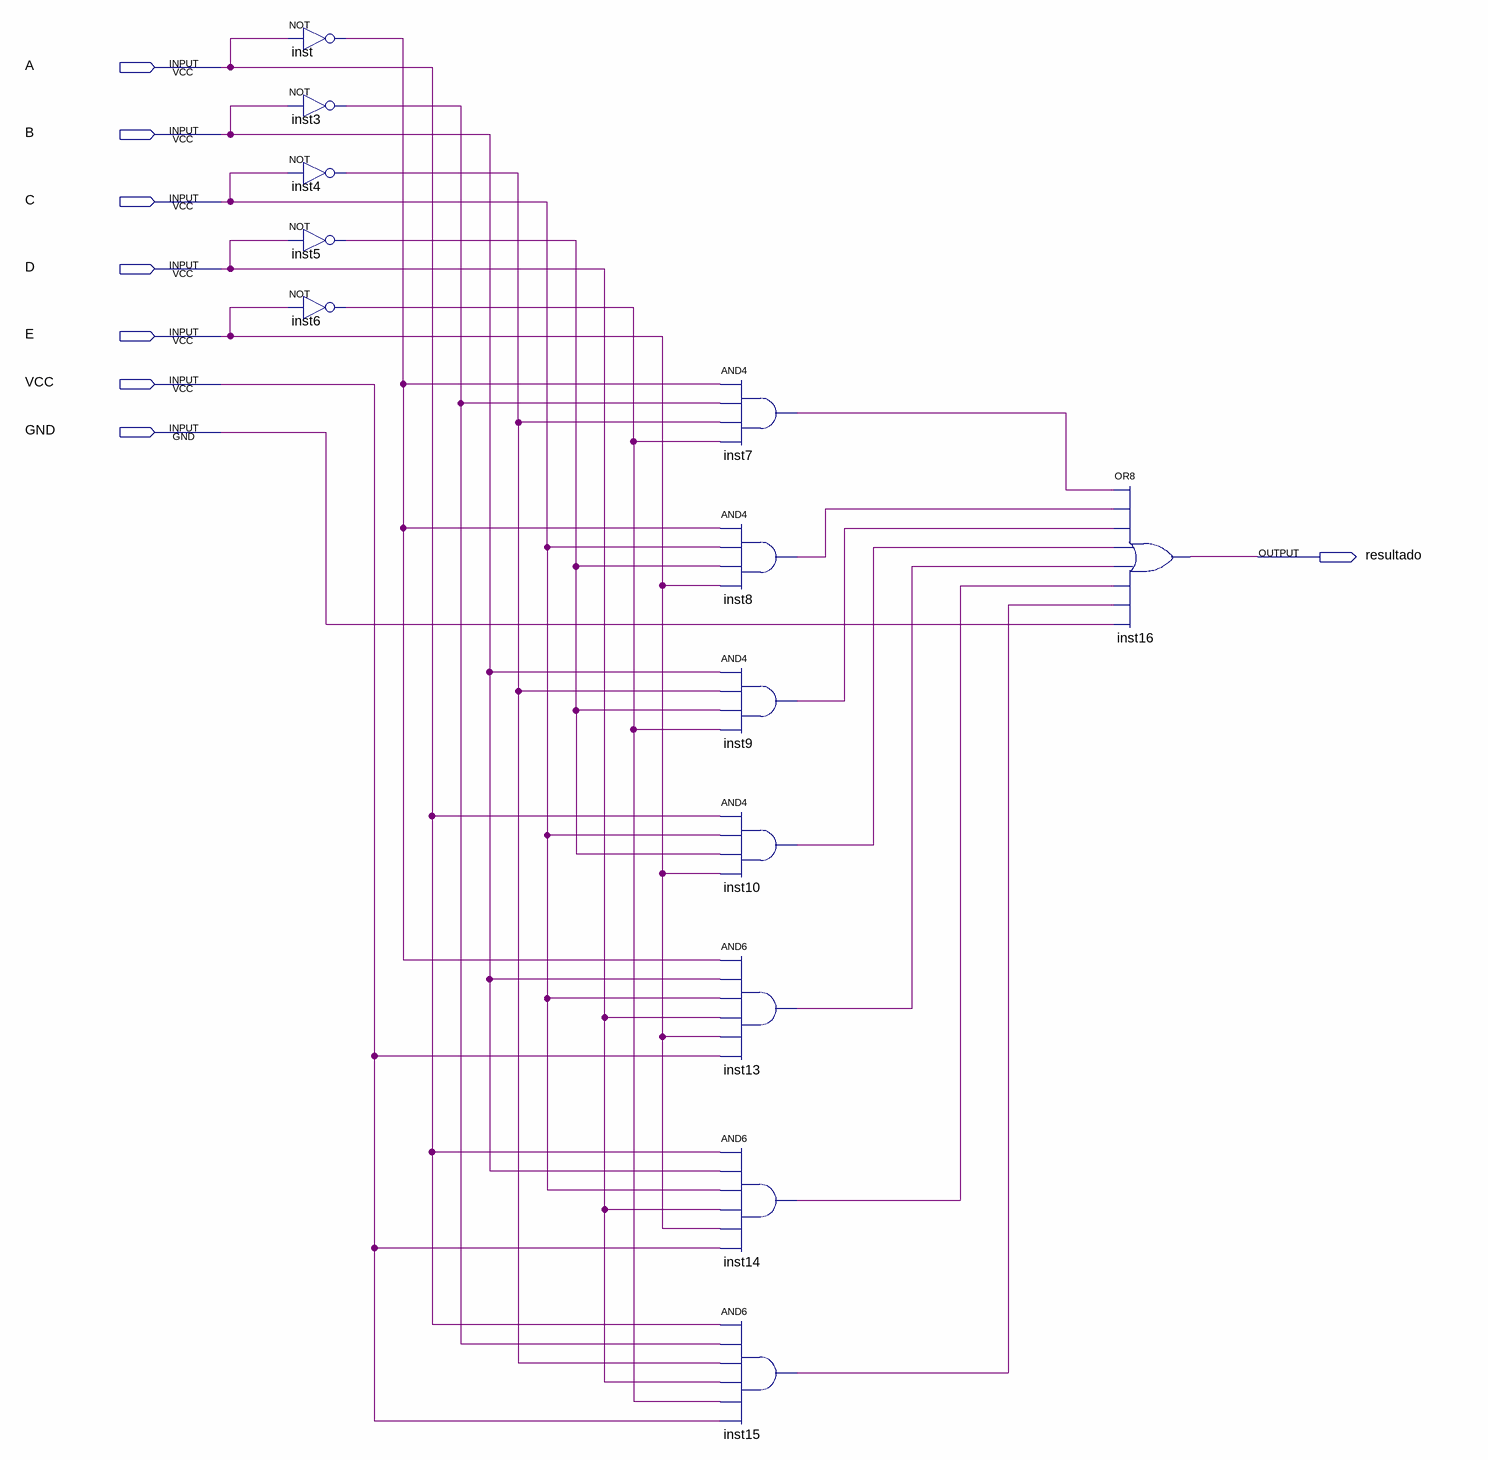
[diagram p0: schematic sheet]
// Quartus schematic lab02.bdf as structural Verilog: 13 symbols, 8 pins
module lab02 (
  input  A,
  input  B,
  input  C,
  input  D,
  input  E,
  input  VCC,
  input  GND,
  output resultado
);

  wire inst3_out, inst4_out, inst5_out, inst6_out, inst7_out, inst8_out, inst9_out, inst10_out, inst13_out,
       inst14_out, inst15_out, inst_out;

  not inst (inst_out, A);
  not inst3 (inst3_out, B);
  not inst4 (inst4_out, C);
  not inst5 (inst5_out, D);
  not inst6 (inst6_out, E);
  and inst7 (inst7_out, inst_out, inst3_out, inst4_out, inst6_out);
  and inst8 (inst8_out, inst_out, C, inst5_out, E);
  and inst9 (inst9_out, B, inst4_out, inst5_out, inst6_out);
  and inst10 (inst10_out, A, C, inst5_out, E);
  and inst13 (inst13_out, inst_out, B, C, D, E, VCC);
  and inst14 (inst14_out, A, B, C, D, E, VCC);
  and inst15 (inst15_out, A, inst3_out, inst4_out, D, inst6_out, VCC);
  or inst16 (resultado, inst7_out, inst8_out, inst9_out, inst10_out, inst13_out, inst14_out, inst15_out, GND);
endmodule
